# EAGLE schematic Block Diagram (EAGLE 8.0.1)
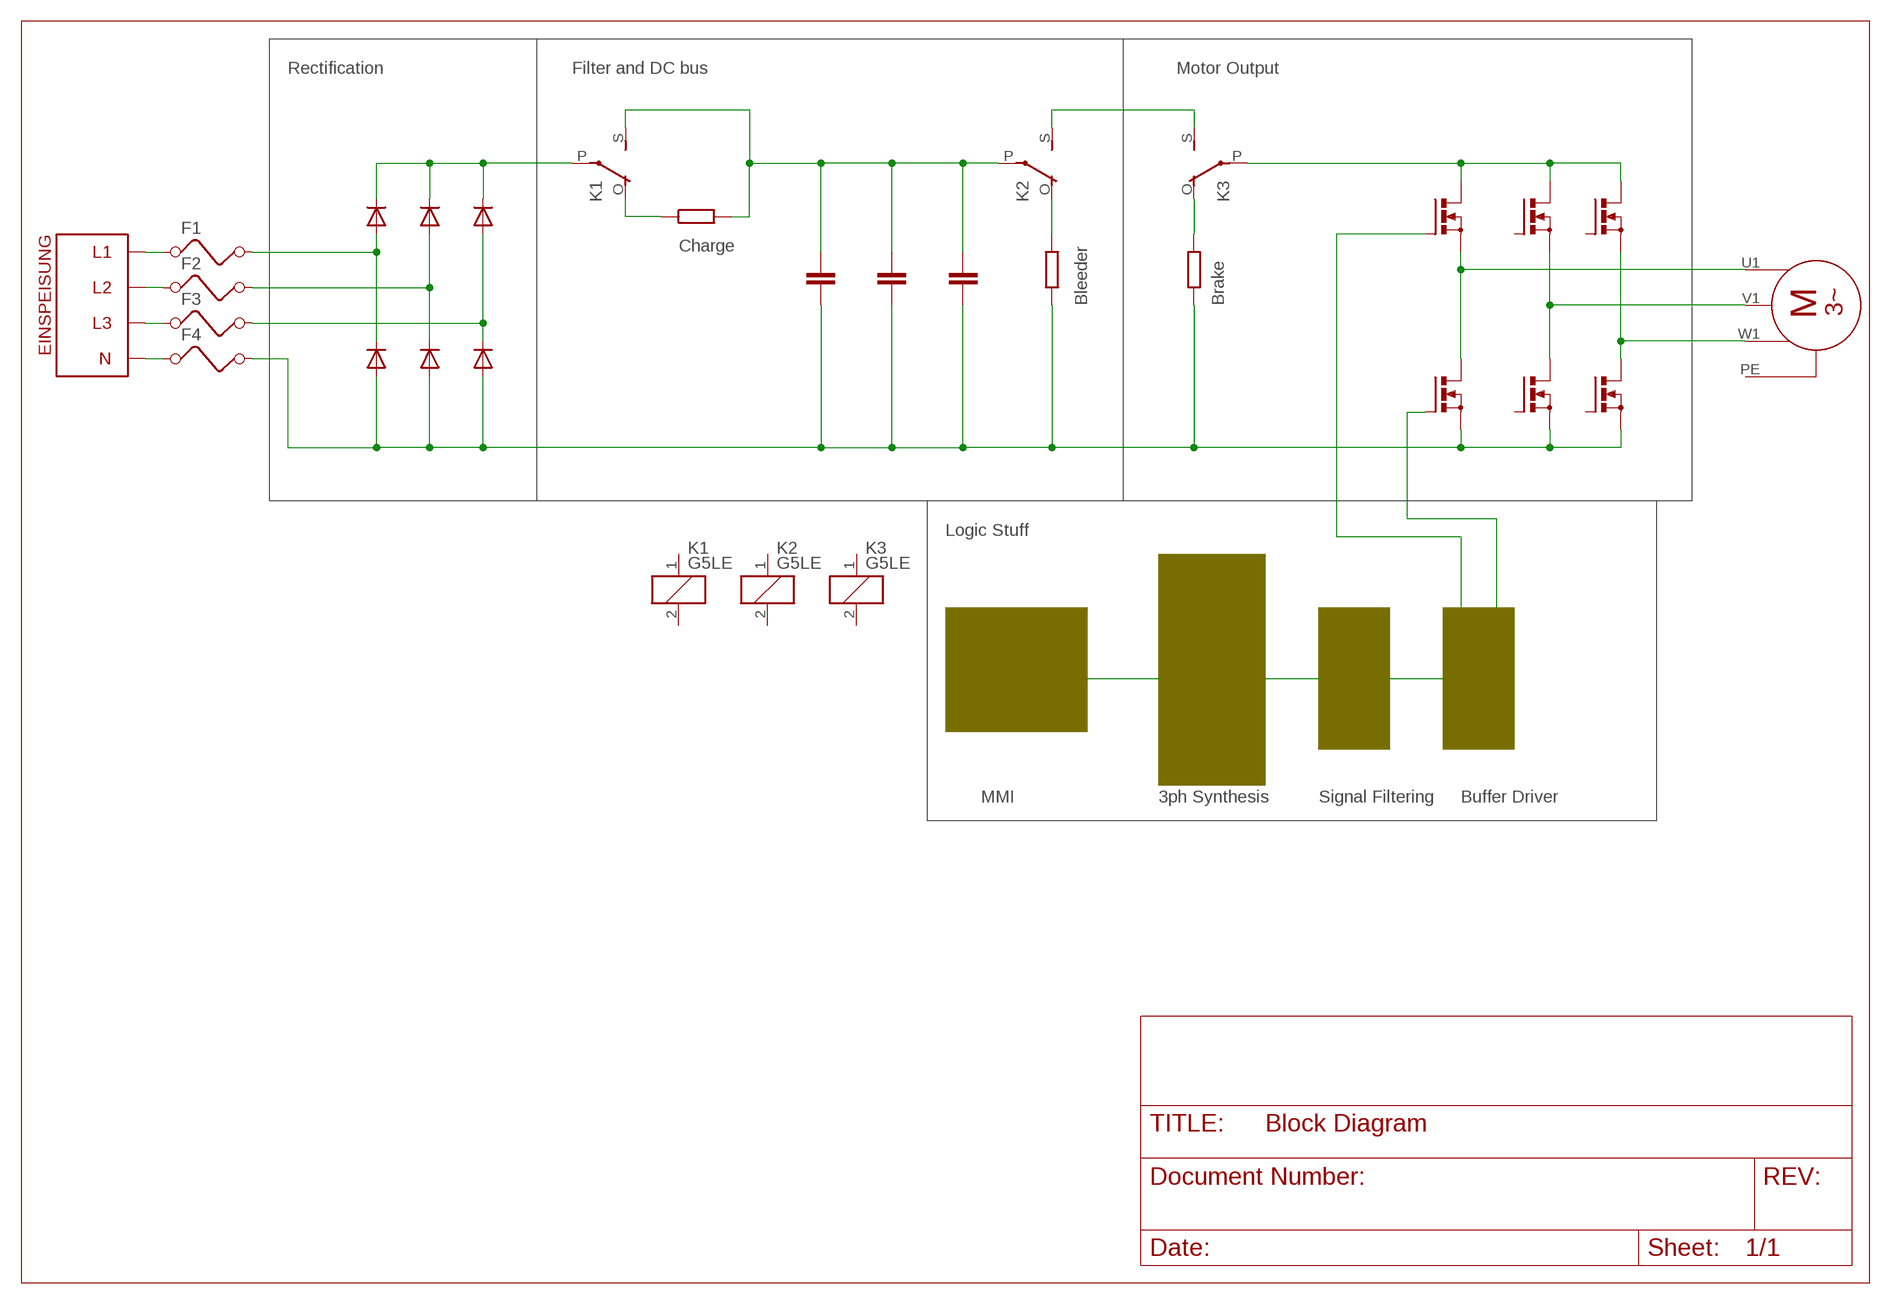
[diagram p0: schematic, sheet 1]

## Parts
F1  FUSE  [FUSE]
F2  FUSE  [FUSE]
F3  FUSE  [FUSE]
F4  FUSE  [FUSE]
K1  G5LE  [G5LE]
K2  G5LE  [G5LE]
K3  G5LE  [G5LE]
M1  MOTOR_3-POL_PE  [MOTOR_3-POL_PE]
Q1  IRF512  [TO220BV]
Q2  IRF512  [TO220BV]
Q3  IRF512  [TO220BV]
Q4  IRF512  [TO220BV]
Q5  IRF512  [TO220BV]
Q6  IRF512  [TO220BV]

## Nets
L1-EXT: F1.1
L2-EXT: F2.1
L3-EXT: F3.1
N$1: K3.P(2:P) Q1.D Q2.D Q3.D
N$2: K1.P(2:P)
N$3: K1.S(2:S) K2.P(2:P)
N$4: K3.O(2:O)
N$5: F4.2 Q4.S Q5.S Q6.S
N$6: M1.U1 Q1.S Q6.D
N$7: M1.V1 Q2.S Q5.D
N$8: Q1.G
N$9: M1.W1 Q3.S Q4.D
N$10: K2.S(2:S) K3.S(2:S)
N$13: Q6.G
N$14: K1.O(2:O)
N$15: K2.O(2:O)
N$16: F1.2
N$17: F2.2
N$18: F3.2
PE-EXT: F4.1
Unconnected: K1.1 K1.2 K2.1 K2.2 K3.1 K3.2 M1.PE Q2.G Q3.G Q4.G Q5.G

## Notes on the sheet
- Rectification | Filter and DC bus | Motor Output
- Charge
- Bleeder | Brake
- Logic Stuff
- MMI | 3ph Synthesis | Signal Filtering | Buffer Driver

## Library data of the parts
F1-F4 = special:FUSE: FUSE 5 x 20 mm
K1-K3 = relay:G5LE: RELAY 1 x switch, 10 A/120 V AC, 8 A/30 V DC, Omron; OC_FARNELL: unknown; OC_NEWARK: unknown
M1 = e-motoren:MOTOR_3-POL_PE: 3-Phasen-Motor mit PE
Q1-Q6 = transistor-power:IRF512: N-CHANNEL MOS FET